# Altium schematic sheet mic.SchDoc
size A
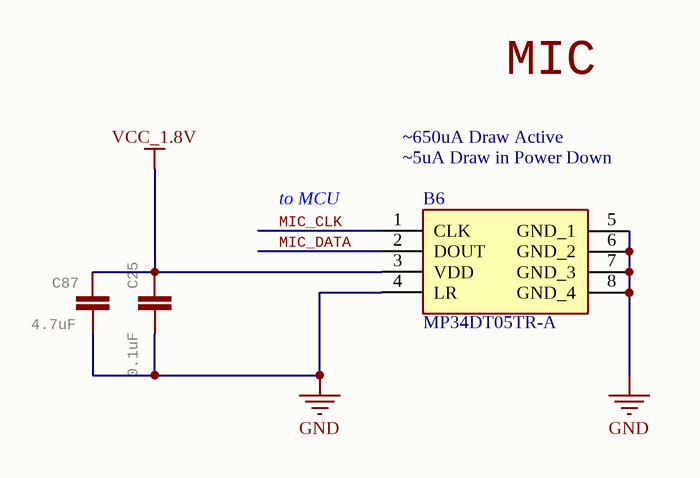
[diagram p0: mic.SchDoc]

## Parts
B6  MP34DT05TR-A  [MP34DT05TRA]
C25  0.1uF  [0402-CAP]
C87  4.7uF  [0402-CAP]

## Nets
GND: B6.4(LR) B6.5(GND_1) B6.6(GND_2) B6.7(GND_3) B6.8(GND_4) C25.2 C87.1
VCC_1.8V: B6.3(VDD) C25.1 C87.2
MIC_CLK: B6.1(CLK)
MIC_DATA: B6.2(DOUT)

## Notes on the sheet
- (near B6) ~5uA Draw in Power Down
- ~650uA Draw Active
- MIC
- to MCU

## Library data of the parts
B6 = MP34DT05TR-A: STMICROELECTRONICS - MP34DT05TR-A - MEMS MICROPHONE, 3.6V, HCLGA-4; Geometry.Height: 1mm; Mouser Part Number: 511-MP34DT05TR-A; Mouser Price/Stock: https://www.mouser.co.uk/ProductDetail/STMicroelectronics/MP34DT05TR-A?qs=BZBei1rCqCAMJfcA0UxAnA%3D%3D; Manufacturer_Name: STMicroelectronics; Manufacturer_Part_Number: MP34DT05TR-A; Datasheet Link: http://www.st.com/content/ccc/resource/technical/document/datasheet/group3/c7/90/d3/f6/b7/e7/40/c8/DM00415595/files/DM00415595.pdf/jcr:content/translations/en.DM00415595.pdf; Part Number: MP34DT05TR-A; MPN: MP34DT05TR-A
C25 = C-EUC0201: CAPACITOR, European symbol; MPN: C0402C104Z4VAC; GateName_1: G$1; SymbolName_1: C-EU; POPULARITY: 0; LibraryName: rcl; DeviceSetName: C-EU; SPICEPREFIX: C; Part Number: C0402C104Z4VAC
C87 = CAP0402-CAP: CapacitorStandard 0603 ceramic capacitor, and 0.1" leaded capacitor.; MPN: JMK105BBJ475MV-F; GateName_1: G$1; SymbolName_1: CAP; DeviceName: 0402-CAP; LibraryName: sfe; DeviceSetName: CAP; Part Number: JMK105BBJ475MV-F